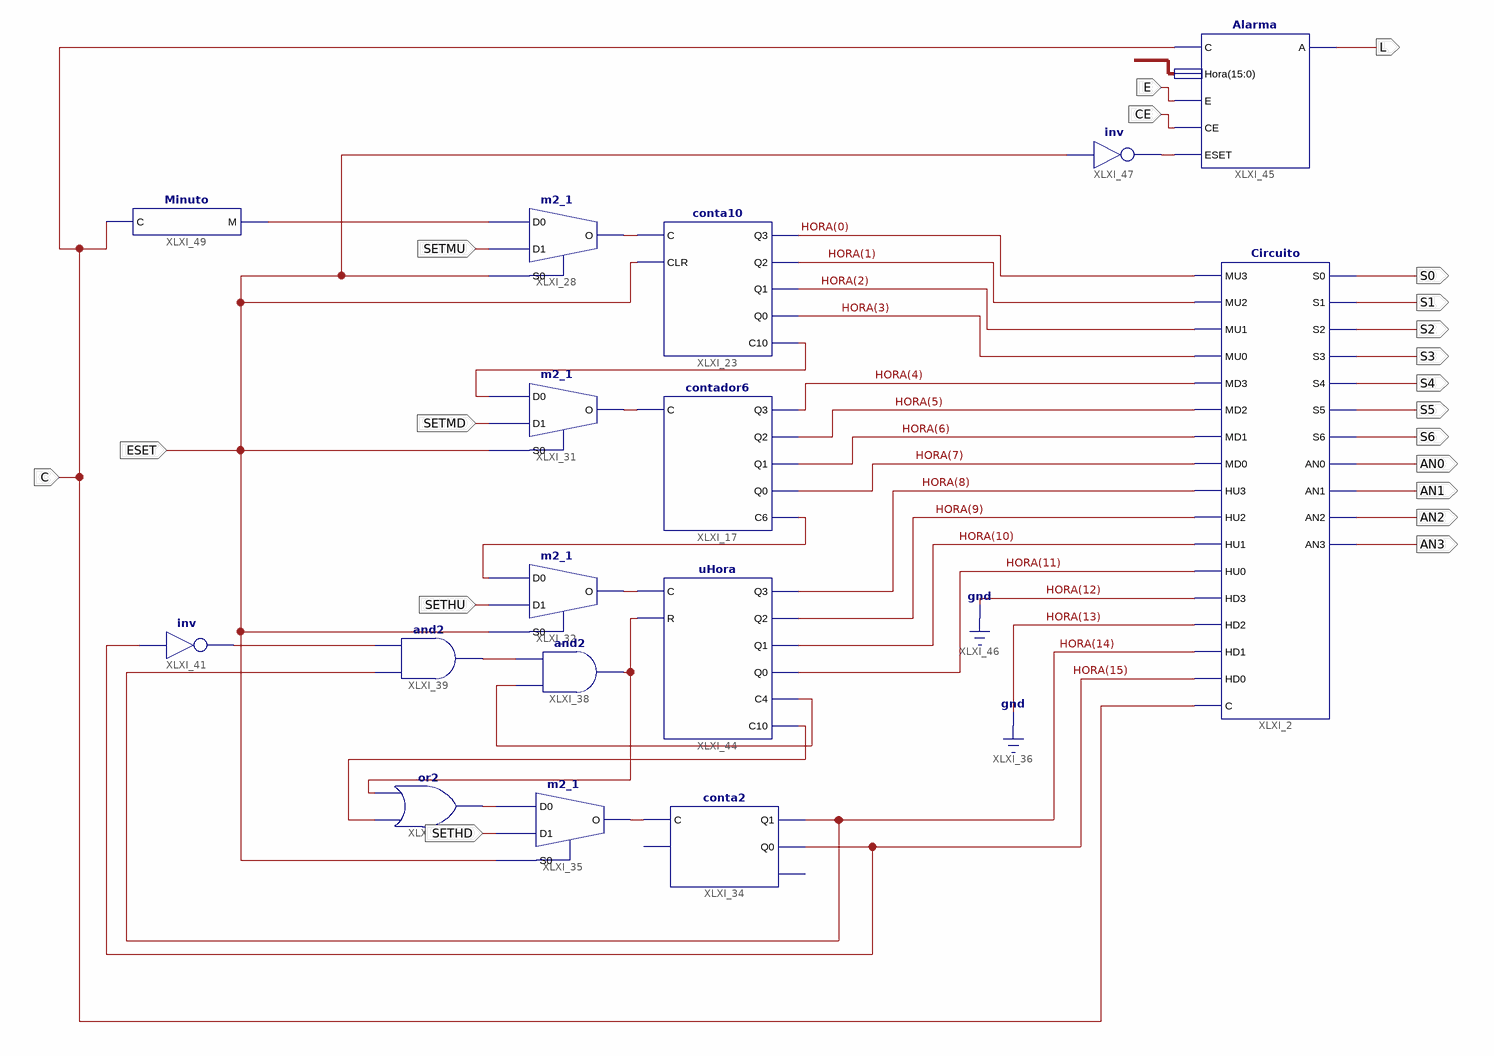
[diagram p0: schematic sheet 1]
// Xilinx ISE schematic reloj.sch (spartan3e) as structural Verilog: 16 symbols, 20 ports
module reloj (
  input  C,
  input  ESET,
  input  SETMU,
  input  SETMD,
  input  SETHU,
  input  SETHD,
  input  E,
  input  CE,
  output S0,
  output S1,
  output S2,
  output S3,
  output S4,
  output S5,
  output S6,
  output AN0,
  output AN1,
  output AN2,
  output AN3,
  output L
);

  wire XLXN_60, XLXN_69, XLXN_76, XLXN_78, XLXN_81, XLXN_89, XLXN_120, XLXN_124, XLXN_129, XLXN_146,
       XLXN_163, XLXN_164, XLXN_165, XLXN_194;
  wire [15:0] HORA;

  contador6 XLXI_17 (.C(XLXN_69), .C6(XLXN_81), .Q0(HORA[7]), .Q1(HORA[6]), .Q2(HORA[5]), .Q3(HORA[4]));
  conta10 XLXI_23 (.C(XLXN_60), .C10(XLXN_78), .CLR(ESET), .Q0(HORA[3]), .Q1(HORA[2]), .Q2(HORA[1]), .Q3(HORA[0]));
  m2_1 XLXI_28 (.D0(XLXN_76), .D1(SETMU), .S0(ESET), .O(XLXN_60));
  m2_1 XLXI_31 (.D0(XLXN_78), .D1(SETMD), .S0(ESET), .O(XLXN_69));
  m2_1 XLXI_32 (.D0(XLXN_81), .D1(SETHU), .S0(ESET), .O(XLXN_120));
  conta2 XLXI_34 (.C(XLXN_146), .Q0(HORA[15]), .Q1(HORA[14]));  // open: C2, R
  m2_1 XLXI_35 (.D0(XLXN_163), .D1(SETHD), .S0(ESET), .O(XLXN_146));
  Circuito XLXI_2 (
    .AN0(AN0), .AN1(AN1), .AN2(AN2), .AN3(AN3), .C(C), .HD0(HORA[15]), .HD1(HORA[14]), .HD2(1'b0),
    .HD3(1'b0), .HU0(HORA[11]), .HU1(HORA[10]), .HU2(HORA[9]), .HU3(HORA[8]), .MD0(HORA[7]), .MD1(HORA[6]),
    .MD2(HORA[5]), .MD3(HORA[4]), .MU0(HORA[3]), .MU1(HORA[2]), .MU2(HORA[1]), .MU3(HORA[0]), .S0(S0),
    .S1(S1), .S2(S2), .S3(S3), .S4(S4), .S5(S5), .S6(S6));
  and XLXI_38 (XLXN_164, XLXN_165, XLXN_124);
  and XLXI_39 (XLXN_124, HORA[14], XLXN_129);
  not XLXI_41 (XLXN_129, HORA[15]);
  or XLXI_43 (XLXN_163, XLXN_89, XLXN_164);
  uHora XLXI_44 (
    .C(XLXN_120), .C10(XLXN_89), .C4(XLXN_165), .Q0(HORA[11]), .Q1(HORA[10]), .Q2(HORA[9]), .Q3(HORA[8]),
    .R(XLXN_164));
  Alarma XLXI_45 (.A(L), .C(C), .CE(CE), .E(E), .ESET(XLXN_194), .Hora({HORA[15:14], 2'b00, HORA[11:0]}));
  not XLXI_47 (XLXN_194, ESET);
  Minuto XLXI_49 (.C(C), .M(XLXN_76));
endmodule
